# EAGLE schematic LSU 4.9 OpenAFR Gauge (EAGLE 9.6.2)
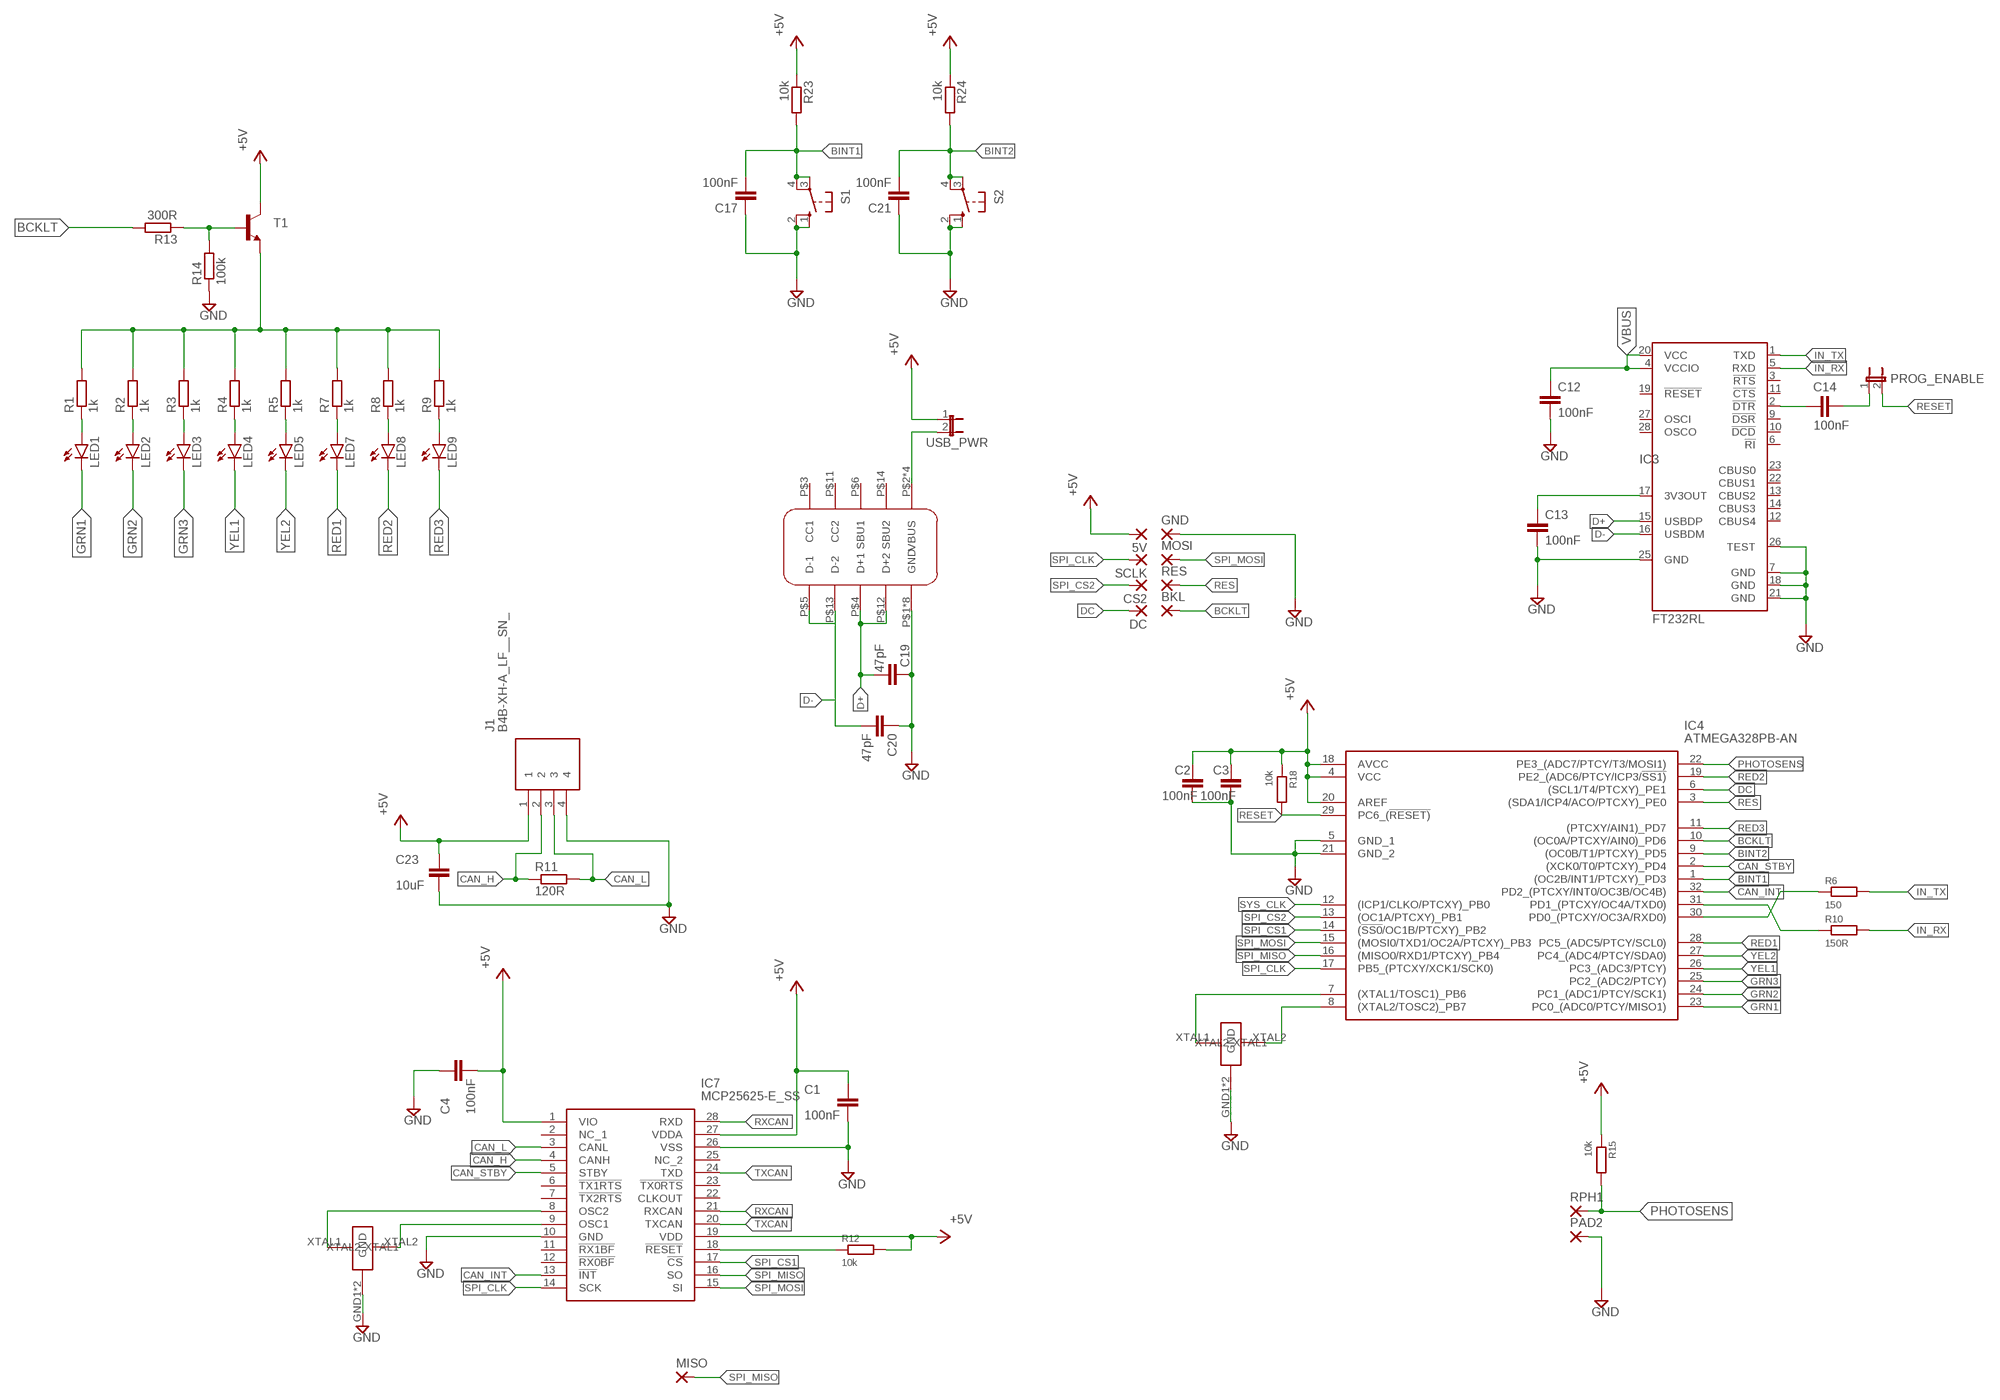
[diagram p0: schematic, sheet 1]

## Parts
5V  1,6/0,9  [1,6/0,9]
BKL  1,6/0,9  [1,6/0,9]
C1  100nF  C-EUC0805  [C0805]
C2  100nF  C-EUC0805  [C0805]
C3  100nF  C-EUC0805  [C0805]
C4  100nF  C-EUC0805  [C0805]
C12  100nF  C-EUC0805  [C0805]
C13  100nF  C-EUC0805  [C0805]
C14  100nF  C-EUC0805  [C0805]
C17  100nF  C-EUC0805  [C0805]
C19  47pF  C-EUC0805  [C0805]
C20  47pF  C-EUC0805  [C0805]
C21  100nF  C-EUC0805  [C0805]
C23  10uF  C-EUC0805  [C0805]
CS2  1,6/0,9  [1,6/0,9]
DC  1,6/0,9  [1,6/0,9]
GND  1,6/0,9  [1,6/0,9]
IC3  FT232RL  [SSOP28]
IC4  ATMEGA328PB-AN  [QFP80P900X900X120-32N]
IC7  MCP25625-E_SS  [SOP65P780X200-28N]
J1  B4B-XH-A_LF__SN_  [B4BXHALFSN]
LED1  LEDCHIPLED_1206  [CHIPLED_1206]
LED2  LEDCHIPLED_1206  [CHIPLED_1206]
LED3  LEDCHIPLED_1206  [CHIPLED_1206]
LED4  LEDCHIPLED_1206  [CHIPLED_1206]
LED5  LEDCHIPLED_1206  [CHIPLED_1206]
LED7  LEDCHIPLED_1206  [CHIPLED_1206]
LED8  LEDCHIPLED_1206  [CHIPLED_1206]
LED9  LEDCHIPLED_1206  [CHIPLED_1206]
MISO  1,6/0,9  [1,6/0,9]
MOSI  1,6/0,9  [1,6/0,9]
PAD2  1,6/0,8  [1,6/0,8]
PROG_ENABLE  JP1E  [JP1]
R1  1k  R-EU_R0805  [R0805]
R2  1k  R-EU_R0805  [R0805]
R3  1k  R-EU_R0805  [R0805]
R4  1k  R-EU_R0805  [R0805]
R5  1k  R-EU_R0805  [R0805]
R6  150  R-EU_R0805  [R0805]
R7  1k  R-EU_R0805  [R0805]
R8  1k  R-EU_R0805  [R0805]
R9  1k  R-EU_R0805  [R0805]
R10  150R  R-EU_R0805  [R0805]
R11  120R  R-EU_R1206  [R1206]
R12  10k  R-EU_R0805  [R0805]
R13  300R  R-EU_R0805  [R0805]
R14  100k  R-EU_R0805  [R0805]
R15  10k  R-EU_R0805  [R0805]
R18  10k  R-EU_R0805  [R0805]
R23  10k  R-EU_R0805  [R0805]
R24  10k  R-EU_R0805  [R0805]
RES  1,6/0,9  [1,6/0,9]
RPH1  1,6/0,8  [1,6/0,8]
S1  10-XX  [B3F-10XX]
S2  10-XX  [B3F-10XX]
SCLK  1,6/0,9  [1,6/0,9]
T1  BC817-16-NPN-SOT23-BEC  [SOT23-BEC]
U$1  USBC-2.0-THT  [USBC-2.0-THT]
U$2  E3X160181X04  [E3X160181X04]
U$3  E3X160181X04  [E3X160181X04]
USB_PWR  JP1E  [JP1]

## Nets
+5V: 5V.1(P) C1.1 C2.1 C3.1 C4.2 C23.1 IC4.4(VCC) IC4.18(AVCC) IC4.20(AREF) IC7.1(VIO) IC7.19(VDD) IC7.27(VDDA) J1.1 R12.2 R15.1 R18.1 R23.1 R24.1 T1.C USB_PWR.1
BCKLT: BKL.1(P) IC4.10((OC0A/PTCXY/AIN0)_PD6) R13.2
BINT1: C17.2 IC4.1((OC2B/INT1/PTCXY)_PD3) R23.2 S1.3(P) S1.4(P1)
BINT2: C21.2 IC4.9((OC0B/T1/PTCXY)_PD5) R24.2 S2.3(P) S2.4(P1)
CAN_H: IC7.4(CANH) J1.2 R11.1
CAN_INT: IC4.32(PD2_(PTCXY/INT0/OC3B/OC4B)) IC7.13(!INT)
CAN_L: IC7.3(CANL) J1.3 R11.2
CAN_STBY: IC4.2((XCK0/T0/PTCXY)_PD4) IC7.5(STBY)
D+: C19.2 IC3.15(USBDP) U$1.P$4(D+1) U$1.P$12(D+2)
D-: C20.2 IC3.16(USBDM) U$1.P$5(D-1) U$1.P$13(D-2)
DC: DC.1(P) IC4.6((SCL1/T4/PTCXY)_PE1)
GND: C1.2 C2.2 C3.2 C4.1 C12.2 C13.2 C17.1 C19.1 C20.1 C21.1 C23.2 GND.1(P) IC3.7(GND) IC3.18(GND) IC3.21(GND) IC3.25(GND) IC3.26(TEST) IC4.5(GND_1) IC4.21(GND_2) IC7.10(GND) IC7.26(VSS) J1.4 PAD2.1(P) R14.1 S1.1(S) S1.2(S1) S2.1(S) S2.2(S1) U$1.P$1(GND) U$1.P$8(GND) U$1.P$9(GND) U$1.P$16(GND) U$1.P$17(GND) U$1.P$18(GND) U$1.P$19(GND) U$1.P$20(GND) U$2.GND1(GND) U$2.GND2(GND) U$3.GND1(GND) U$3.GND2(GND)
GRN1: IC4.23(PC0_(ADC0/PTCY/MISO1)) LED1.C
GRN2: IC4.24(PC1_(ADC1/PTCY/SCK1)) LED2.C
GRN3: IC4.25(PC2_(ADC2/PTCY)) LED3.C
IN_RX: IC3.5(RXD) R10.2
IN_TX: IC3.1(TXD) R6.2
N$1: LED1.A R1.1
N$2: IC4.30(PD0_(PTCXY/OC3A/RXD0)) R6.1
N$3: LED2.A R2.1
N$4: LED3.A R3.1
N$5: LED4.A R4.1
N$6: LED5.A R5.1
N$7: IC4.31(PD1_(PTCXY/OC4A/TXD0)) R10.1
N$8: LED7.A R7.1
N$9: LED8.A R8.1
N$10: LED9.A R9.1
N$11: IC7.9(OSC1) U$2.XTAL2
N$12: IC7.8(OSC2) U$2.XTAL1
N$13: IC7.18(!RESET) R12.1
N$14: IC4.8((XTAL2/TOSC2)_PB7) U$3.XTAL2
N$15: R1.2 R2.2 R3.2 R4.2 R5.2 R7.2 R8.2 R9.2 T1.E
N$16: R13.1 R14.2 T1.B
N$19: C14.2 PROG_ENABLE.1
N$21: C13.1 IC3.17(3V3OUT)
N$22: C14.1 IC3.2(!DTR)
N$25: IC4.7((XTAL1/TOSC1)_PB6) U$3.XTAL1
PHOTOSENS: IC4.22(PE3_(ADC7/PTCY/T3/MOSI1)) R15.2 RPH1.1(P)
RED1: IC4.28(PC5_(ADC5/PTCY/SCL0)) LED7.C
RED2: IC4.19(PE2_(ADC6/PTCY/ICP3/!SS1)) LED8.C
RED3: IC4.11((PTCXY/AIN1)_PD7) LED9.C
RES: IC4.3((SDA1/ICP4/ACO/PTCXY)_PE0) RES.1(P)
RESET: IC4.29(PC6_(!RESET)) PROG_ENABLE.2 R18.2
RXCAN: IC7.21(RXCAN) IC7.28(RXD)
SPI_CLK: IC4.17(PB5_(PTCXY/XCK1/SCK0)) IC7.14(SCK) SCLK.1(P)
SPI_CS1: IC4.14((!SS0!/OC1B/PTCXY)_PB2) IC7.17(!CS)
SPI_CS2: CS2.1(P) IC4.13((OC1A/PTCXY)_PB1)
SPI_MISO: IC4.16((MISO0/RXD1/PTCXY)_PB4) IC7.16(SO) MISO.1(P)
SPI_MOSI: IC4.15((MOSI0/TXD1/OC2A/PTCXY)_PB3) IC7.15(SI) MOSI.1(P)
SYS_CLK: IC4.12((ICP1/CLKO/PTCXY)_PB0)
TXCAN: IC7.20(TXCAN) IC7.24(TXD)
VBUS: C12.1 IC3.4(VCCIO) IC3.20(VCC) U$1.P$2(VBUS) U$1.P$7(VBUS) U$1.P$10(VBUS) U$1.P$15(VBUS) USB_PWR.2
YEL1: IC4.26(PC3_(ADC3/PTCY)) LED4.C
YEL2: IC4.27(PC4_(ADC4/PTCY/SDA0)) LED5.C
Unconnected: IC3.3(!RTS) IC3.6(!RI) IC3.9(!DSR) IC3.10(!DCD) IC3.11(!CTS) IC3.12(CBUS4) IC3.13(CBUS2) IC3.14(CBUS3) IC3.19(!RESET) IC3.22(CBUS1) IC3.23(CBUS0) IC3.27(OSCI) IC3.28(OSCO) IC7.2(NC_1) IC7.6(!TX1RTS) IC7.7(!TX2RTS) IC7.11(!RX1BF) IC7.12(!RX0BF) IC7.22(CLKOUT) IC7.23(!TX0RTS) IC7.25(NC_2) U$1.P$3(CC1) U$1.P$6(SBU1) U$1.P$11(CC2) U$1.P$14(SBU2)

## Library data of the parts
5V BKL CS2 DC GND MISO MOSI RES SCLK = wirepad:1,6/0,9: THROUGH-HOLE PAD
C1-C4 C12-C14 C17 C19-C21 C23 = rcl:C-EU: CAPACITOR, European symbol; SPICEPREFIX: C
IC3 = ftdichip:FT232R: Source: http://www.ftdichip.com/Documents/DataSheets/DS_FT232R_v104.pdf; MPN: FT232RL; OC_FARNELL: 1146032; OC_NEWARK: 91K9918
IC4 = ATMEGA328PB-AN:ATMEGA328PB-AN: MCU 8-bit ATmega AVR RISC 32KB Flash 2.5V/3.3V/5V 32-Pin TQFP Tray Source: Datasheet <http://ww1.microchip.com/downloads/en/DeviceDoc/40001906C.pdf>; DESCRIPTION: MCU 8-bit ATmega AVR RISC 32KB Flash 2.5V/3.3V/5V 32-Pin TQFP Tray; HEIGHT: 1.2mm; MANUFACTURER_NAME: Microchip; MANUFACTURER_PART_NUMBER: ATMEGA328PB-AN; MOUSER_PART_NUMBER: 556-ATMEGA328PB-AN; MOUSER_PRICE-STOCK: https://www.mouser.co.uk/ProductDetail/Microchip-Technology/ATMEGA328PB-AN?qs=jy4bLUHv09gDoS2J01KCIw%3D%3D
IC7 = MCP25625-E_SS:MCP25625-E_SS: CAN Controller with Transceiver SSOP28 Microchip MCP25625-E/SS, CAN Controller 1MBps CAN 2.0, 28-Pin SSOP Source: Datasheet <https://datasheet.datasheetarchive.com/originals/distributors/Datasheets-DGA14/1192265.pdf>; DESCRIPTION: CAN Controller with Transceiver SSOP28 Microchip MCP25625-E/SS, CAN Controller 1MBps CAN 2.0, 28-Pin SSOP; HEIGHT: 2mm; MANUFACTURER_NAME: Microchip; MANUFACTURER_PART_NUMBER: MCP25625-E/SS; MOUSER_PART_NUMBER: 579-MCP25625-E/SS; MOUSER_PRICE-STOCK: https://www.mouser.co.uk/ProductDetail/Microchip-Technology/MCP25625-E-SS?qs=YlpJWyuQ3PO6FRVW%2Ffac7A%3D%3D
J1 = B4B-XH-A_LF__SN_:B4B-XH-A_LF__SN_: CONN HEADER VERT 4POS 2.5MM Source: Datasheet <https://datasheet.lcsc.com/szlcsc/JST-Sales-America-B4B-XH-A-LF-SN_C144395.pdf>; DESCRIPTION: CONN HEADER VERT 4POS 2.5MM; HEIGHT: 7mm; MANUFACTURER_NAME: JST (JAPAN SOLDERLESS TERMINALS); MANUFACTURER_PART_NUMBER: B4B-XH-A(LF)(SN); MOUSER_PART_NUMBER: 306-B4BXHALFSN; MOUSER_PRICE-STOCK: https://www.mouser.co.uk/ProductDetail/JST-Commercial/B4B-XH-ALFSN?qs=cdbOS8ANM9CfC08d%252BywhFw%3D%3D
LED1-LED5 LED7-LED9 = led:LED: LED OSRAM: - CHIPLED LG R971, LG N971, LY N971, LG Q971, LY Q971, LO R971, LY R971 LH N974, LH R974 LS Q976, LO Q976, LY Q976 LO Q996 - Hyper CHIPLED LW Q18S LB Q993, LB Q99A, LB R99A - SideLED LS A670, LO A670, LY A670, LG A670, LP A670 LB A673, LV A673, LT A673, LW A673 LH A674 LY A675 LS A676, LA A676, LO A676, LY A676, LW A676 LS A679, LY A679, LG A679 - Hyper Micro SIDELED® LS Y876, LA Y876, LO Y876, LY Y876 LT Y87S - SmartLED LW L88C, LW L88S LB L89C, LB L89S, LG L890 LS L89K, LO L89K, LY L89K LS L896, LA L896, LO L896, LY L896 - TOPLED LS T670, LO T670, LY T670, LG T670, LP T670 LSG T670, LSP T670, LSY T670, LOP T670, LYG T670 LG T671, LOG T671, LSG T671 LB T673, LV T673, LT T673, LW T673 LH T674 LS T676, LA T676, LO T676, LY T676, LB T676, LH T676, LSB T676, LW T676 LB T67C, LV T67C, LT T67C, LS T67K, LO T67K, LY T67K, LW E67C LS E67B, LA E67B, LO E67B, LY E67B, LB E67C, LV E67C, LT E67C LW T67C LS T679, LY T679, LG T679 LS T770, LO T770, LY T770, LG T770, LP T770 LB T773, LV T773, LT T773, LW T773 LH T774 LS E675, LA E675, LY E675, LS T675 LS T776, LA T776, LO T776, LY T776, LB T776 LHGB T686 LT T68C, LB T68C - Hyper Mini TOPLED® LB M676 - Mini TOPLED Santana® LG M470 LS M47K, LO M47K, LY M47K Source: http://www.osram.convergy.de LUXEON: - LUMILED® LXK2-PW12-R00, LXK2-PW12-S00, LXK2-PW14-U00, LXK2-PW14-V00 LXK2-PM12-R00, LXK2-PM12-S00, LXK2-PM14-U00 LXK2-PE12-Q00, LXK2-PE12-R00, LXK2-PE12-S00, LXK2-PE14-T00, LXK2-PE14-U00 LXK2-PB12-K00, LXK2-PB12-L00, LXK2-PB12-M00, LXK2-PB14-N00, LXK2-PB14-P00, LXK2-PB14-Q00 LXK2-PR12-L00, LXK2-PR12-M00, LXK2-PR14-Q00, LXK2-PR14-R00 LXK2-PD12-Q00, LXK2-PD12-R00, LXK2-PD12-S00 LXK2-PH12-R00, LXK2-PH12-S00 LXK2-PL12-P00, LXK2-PL12-Q00, LXK2-PL12-R00 Source: www.luxeon.com KINGBRIGHT: KA-3528ASYC Source: www.kingbright.com
PAD2 RPH1 = wirepad:1,6/0,8: THROUGH-HOLE PAD
PROG_ENABLE USB_PWR = jumper:JP1E: JUMPER
R1-R15 R18 R23 R24 = rcl:R-EU_: RESISTOR, European symbol; SPICEPREFIX: R
S1 S2 = switch-omron:10-XX: OMRON SWITCH; MPN: B3F-1000; OC_FARNELL: 176432; OC_NEWARK: 36M3542
T1 = transistor:*-NPN-: NPN Transistror BF959 corrected 2008.03.06
U$1 = USBC-2.0-THT:USBC-2.0-THT
U$2 U$3 = E3X160181X04:E3X160181X04